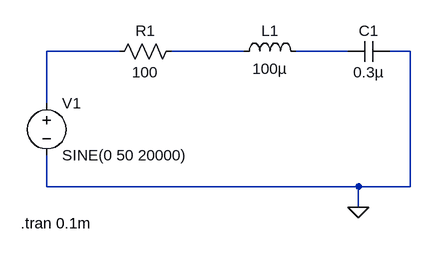
[diagram p0: schematic RLC_Circuit.asc]
RLC_Circuit.asc, the LTspice schematic file:
Version 4.1
SHEET 1 880 680
WIRE 256 96 144 96
WIRE 448 96 336 96
WIRE 608 96 528 96
WIRE 704 96 672 96
WIRE 144 176 144 96
WIRE 144 304 144 256
WIRE 624 304 144 304
WIRE 704 304 704 96
WIRE 704 304 624 304
WIRE 624 336 624 304
FLAG 624 336 0
SYMBOL voltage 144 160 R0
WINDOW 123 0 0 Left 0
WINDOW 39 0 0 Left 0
SYMATTR InstName V1
SYMATTR Value SINE(0 50 20000)
SYMBOL res 352 80 R90
WINDOW 0 0 56 VBottom 2
WINDOW 3 32 56 VTop 2
SYMATTR InstName R1
SYMATTR Value 100
SYMBOL ind 432 112 R270
WINDOW 0 32 56 VTop 2
WINDOW 3 5 56 VBottom 2
SYMATTR InstName L1
SYMATTR Value 100µ
SYMBOL cap 672 80 R90
WINDOW 0 0 32 VBottom 2
WINDOW 3 32 32 VTop 2
SYMATTR InstName C1
SYMATTR Value 0.3µ
TEXT 104 360 Left 2 !.tran 0.1m

The netlist it stands for:
* RLC_Circuit.asc
V1 N001 0 SINE(0 50 20000)
R1 N002 N001 100
L1 N002 N003 100µ
C1 0 N003 0.3µ
.tran 0.1m
.backanno
.end